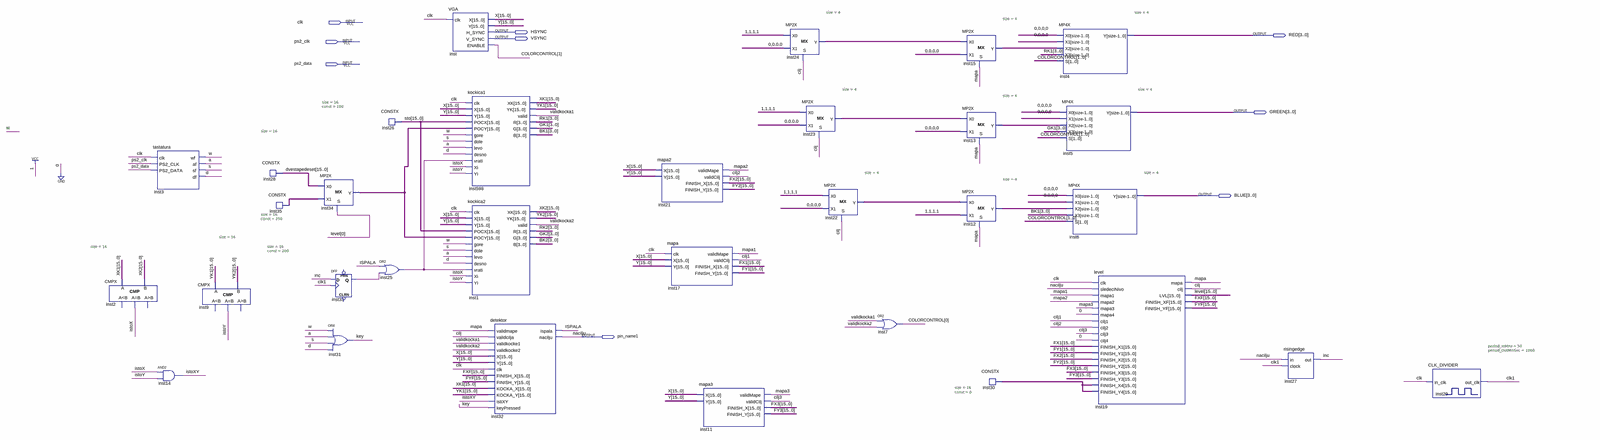
[diagram p0: schematic sheet, whole]
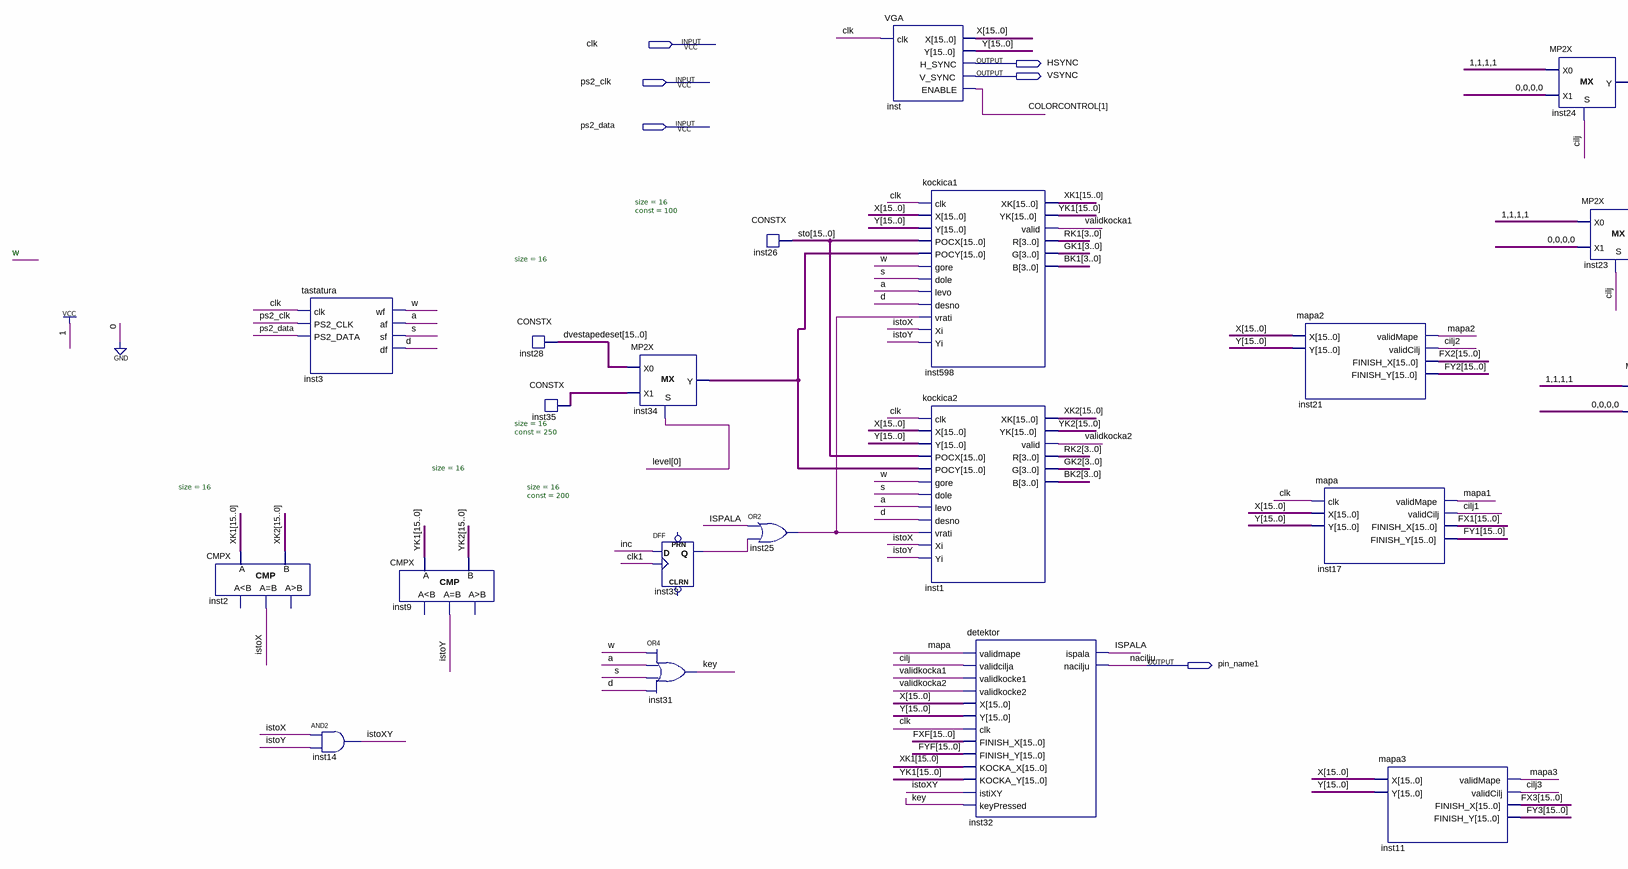
[diagram p1: schematic sheet, left part]
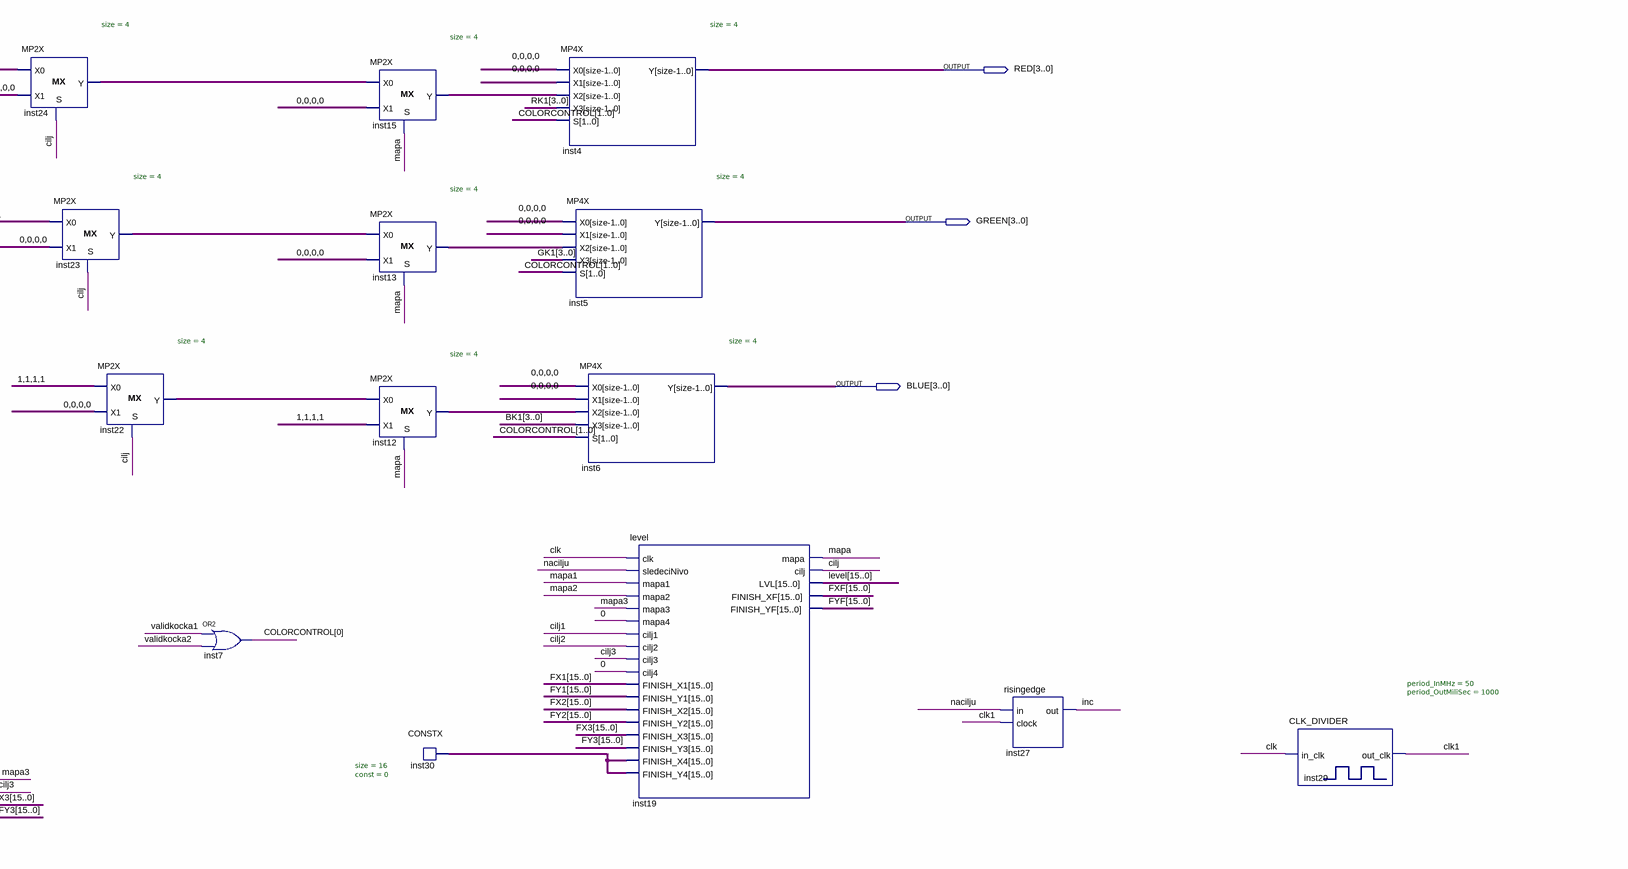
[diagram p2: schematic sheet, right part]
// Quartus schematic bloxorz.bdf as structural Verilog: 32 symbols, 9 pins
module bloxorz (
  input  clk,
  input  ps2_clk,
  input  ps2_data,
  output HSYNC,
  output [3:0] RED,
  output VSYNC,
  output [3:0] GREEN,
  output [3:0] BLUE,
  output pin_name1
);

  wire a, cilj, cilj1, cilj2, cilj3, clk1, d, inc, inst25_out, inst33_q, ISPALA, istoX, istoXY, istoY, key,
       mapa, mapa1, mapa2, mapa3, s, validkocka1, validkocka2, w;
  wire [1:0] COLORCONTROL;
  wire [3:0] BK1, BK2, GK1, GK2, inst12_y, inst13_y, inst15_y, inst22_y, inst23_y, inst24_y, RK1, RK2;
  wire [15:0] dvestapedeset, FX1, FX2, FX3, FXF, FY1, FY2, FY3, FYF, inst30_data, inst34_y, inst35_data,
       level, sto, X, XK1, XK2, Y, YK1, YK2;

  CMPX #(.size(16)) inst2 (.A(XK1), .B(XK2), .eq(istoX));  // open: ls, gr
  tastatura inst3 (.clk(clk), .PS2_CLK(ps2_clk), .PS2_DATA(ps2_data), .wf(w), .af(a), .sf(s), .df(d));
  and inst14 (istoXY, istoX, istoY);
  CMPX #(.size(16)) inst9 (.A(YK1), .B(YK2), .eq(istoY));  // open: ls, gr
  CONSTX #(.size(16), .\const (250)) inst28 (.data(dvestapedeset));
  CONSTX #(.size(16), .\const (200)) inst35 (.data(inst35_data));
  MP2X #(.size(16)) inst34 (.S(level[0]), .X0(dvestapedeset), .X1(inst35_data), .Y(inst34_y));
  DFF inst33 (.CLK(clk1), .D(inc), .Q(inst33_q));  // open: CLRN, PRN
  or inst31 (key, w, a, s, d);
  CONSTX #(.size(16), .\const (100)) inst26 (.data(sto));
  or inst25 (inst25_out, ISPALA, inst33_q);
  VGA inst (.clk(clk), .X(X), .Y(Y), .H_SYNC(HSYNC), .V_SYNC(VSYNC), .ENABLE(COLORCONTROL[1]));
  kockica1 inst598 (
    .clk(clk), .X(X), .Y(Y), .POCX(sto), .POCY(inst34_y), .gore(w), .dole(s), .levo(a), .desno(d),
    .vrati(inst25_out), .Xi(istoX), .Yi(istoY), .XK(XK1), .YK(YK1), .valid(validkocka1), .R(RK1), .G(GK1),
    .B(BK1));
  kockica2 inst1 (
    .clk(clk), .X(X), .Y(Y), .POCX(sto), .POCY(inst34_y), .gore(w), .dole(s), .levo(a), .desno(d),
    .vrati(inst25_out), .Xi(istoX), .Yi(istoY), .XK(XK2), .YK(YK2), .valid(validkocka2), .R(RK2), .G(GK2),
    .B(BK2));
  detektor inst32 (
    .validmape(mapa), .validcilja(cilj), .validkocke1(validkocka1), .validkocke2(validkocka2), .X(X), .Y(Y),
    .clk(clk), .FINISH_X(FXF), .FINISH_Y(FYF), .KOCKA_X(XK1), .KOCKA_Y(YK1), .istiXY(istoXY),
    .keyPressed(key), .ispala(ISPALA), .nacilju(pin_name1));
  mapa2 inst21 (.X(X), .Y(Y), .validMape(mapa2), .validCilj(cilj2), .FINISH_X(FX2), .FINISH_Y(FY2));
  mapa inst17 (.clk(clk), .X(X), .Y(Y), .validMape(mapa1), .validCilj(cilj1), .FINISH_X(FX1), .FINISH_Y(FY1));
  mapa3 inst11 (.X(X), .Y(Y), .validMape(mapa3), .validCilj(cilj3), .FINISH_X(FX3), .FINISH_Y(FY3));
  MP2X #(.size(4)) inst24 (.S(cilj), .X0(4'b1111), .X1(4'b0000), .Y(inst24_y));
  MP2X #(.size(4)) inst23 (.S(cilj), .X0(4'b1111), .X1(4'b0000), .Y(inst23_y));
  MP2X #(.size(4)) inst22 (.S(cilj), .X0(4'b1111), .X1(4'b0000), .Y(inst22_y));
  or inst7 (COLORCONTROL[0], validkocka1, validkocka2);
  MP2X #(.size(4)) inst15 (.S(mapa), .X0(inst24_y), .X1(4'b0000), .Y(inst15_y));
  MP2X #(.size(4)) inst13 (.S(mapa), .X0(inst23_y), .X1(4'b0000), .Y(inst13_y));
  MP2X #(.size(4)) inst12 (.S(mapa), .X0(inst22_y), .X1(4'b1111), .Y(inst12_y));
  CONSTX #(.size(16), .\const (0)) inst30 (.data(inst30_data));
  MP4X #(.size(4)) inst4 (.X0(4'b0000), .X1(4'b0000), .X2(inst15_y), .X3(RK1), .S(COLORCONTROL), .Y(RED));
  MP4X #(.size(4)) inst5 (.X0(4'b0000), .X1(4'b0000), .X2(inst13_y), .X3(GK1), .S(COLORCONTROL), .Y(GREEN));
  MP4X #(.size(4)) inst6 (.X0(4'b0000), .X1(4'b0000), .X2(inst12_y), .X3(BK1), .S(COLORCONTROL), .Y(BLUE));
  level inst19 (
    .clk(clk), .sledeciNivo(pin_name1), .mapa1(mapa1), .mapa2(mapa2), .mapa3(mapa3), .mapa4(1'b0),
    .cilj1(cilj1), .cilj2(cilj2), .cilj3(cilj3), .cilj4(1'b0), .FINISH_X1(FX1), .FINISH_Y1(FY1),
    .FINISH_X2(FX2), .FINISH_Y2(FY2), .FINISH_X3(FX3), .FINISH_Y3(FY3), .FINISH_X4(inst30_data),
    .FINISH_Y4(inst30_data), .mapa(mapa), .cilj(cilj), .LVL(level), .FINISH_XF(FXF), .FINISH_YF(FYF));
  risingedge inst27 (.in(pin_name1), .clock(clk1), .out(inc));
  CLK_DIVIDER #(.period_InMHz(50), .period_OutMiliSec(1000)) inst29 (.in_clk(clk), .out_clk(clk1));

  // Other names for the same wires on the sheet: nacilju = pin_name1

  // Notes on the sheet:
  //   w
endmodule
